# EAGLE design BL (EAGLE 9.6.2)
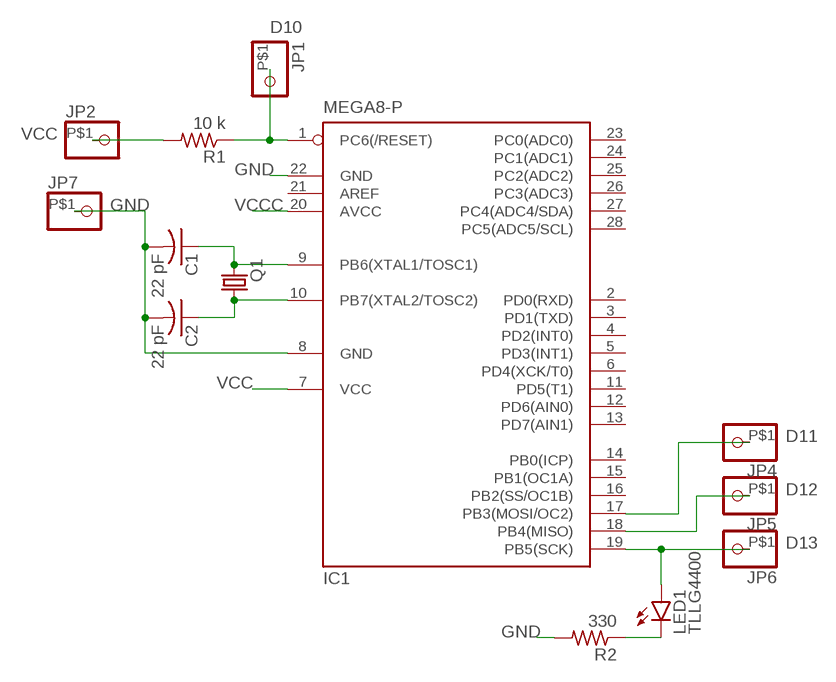
[diagram p0: schematic, sheet 1]

## Parts
C1  22 pF  C-US025-030X050  [C025-030X050]
C2  22 pF  C-US025-030X050  [C025-030X050]
IC1  MEGA8-P  [DIL28-3]
JP1  PINHD-1X1-BIGPOGO  [1X1-BIGPOGO]
JP2  PINHD-1X1-BIGPOGO  [1X1-BIGPOGO]
JP4  PINHD-1X1-BIGPOGO  [1X1-BIGPOGO]
JP5  PINHD-1X1-BIGPOGO  [1X1-BIGPOGO]
JP6  PINHD-1X1-BIGPOGO  [1X1-BIGPOGO]
JP7  PINHD-1X1-BIGPOGO  [1X1-BIGPOGO]
LED1  TLLG4400  [LED3MM]
Q1  CRYSTALHC49S  [HC49/S]
R1  10 k  R-US_0204/7  [0204/7]
R2  330  R-US_0204/7  [0204/7]

## Nets
D10: IC1.1(PC6(/RESET)) JP1.P$1 R1.1
D11: IC1.17(PB3(MOSI/OC2)) JP4.P$1
D12: IC1.18(PB4(MISO)) JP5.P$1
D13: IC1.19(PB5(SCK)) JP6.P$1 LED1.A
GND: C1.2 C2.2 IC1.8(GND) IC1.22(GND) JP7.P$1 R2.2
N$1: C1.1 IC1.9(PB6(XTAL1/TOSC1)) Q1.2
N$2: C2.1 IC1.10(PB7(XTAL2/TOSC2)) Q1.1
N$3: LED1.K(C) R2.1
VCC: IC1.7(VCC) JP2.P$1 R1.2
VCCC: IC1.20(AVCC)
Unconnected: IC1.2(PD0(RXD)) IC1.3(PD1(TXD)) IC1.4(PD2(INT0)) IC1.5(PD3(INT1)) IC1.6(PD4(XCK/T0)) IC1.11(PD5(T1)) IC1.12(PD6(AIN0)) IC1.13(PD7(AIN1)) IC1.14(PB0(ICP)) IC1.15(PB1(OC1A)) IC1.16(PB2(SS/OC1B)) IC1.21(AREF) IC1.23(PC0(ADC0)) IC1.24(PC1(ADC1)) IC1.25(PC2(ADC2)) IC1.26(PC3(ADC3)) IC1.27(PC4(ADC4/SDA)) IC1.28(PC5(ADC5/SCL))

## Library data of the parts
C1 C2 = adafruit:C-US: CAPACITOR, American symbol
IC1 = atmel:MEGA8-P: MICROCONTROLLER 8 Kbytes FLASH, 1 kbytes SRAM, 512 bytes EEPROM, USART, 4-channel 10 bit ADC, 2-channel 8 bit ADC Pin compatible with Atmega48, ATMega88, ATMega168 Source: avr.lbr; OC_FARNELL: unknown; OC_NEWARK: unknown
JP1 JP2 JP4-JP7 = adafruit:PINHD-1X1: Pin header 1x1 for 0.1" spacing With round pins
LED1 = led:TLLG4400: Low Current (2mA) LED 3 mm Tinted Diffused Package color GREEN Source: Data sheet <http://www.farnell.com/datasheets/391098.pdf>; MF: VISHAY SEMICONDUCTOR; OC_FARNELL: 1612435
Q1 = crystal:CRYSTAL: CRYSTAL; OC_FARNELL: 1667008; OC_NEWARK: unknown
R1 R2 = adafruit:R-US_: RESISTOR, American symbol

## Board
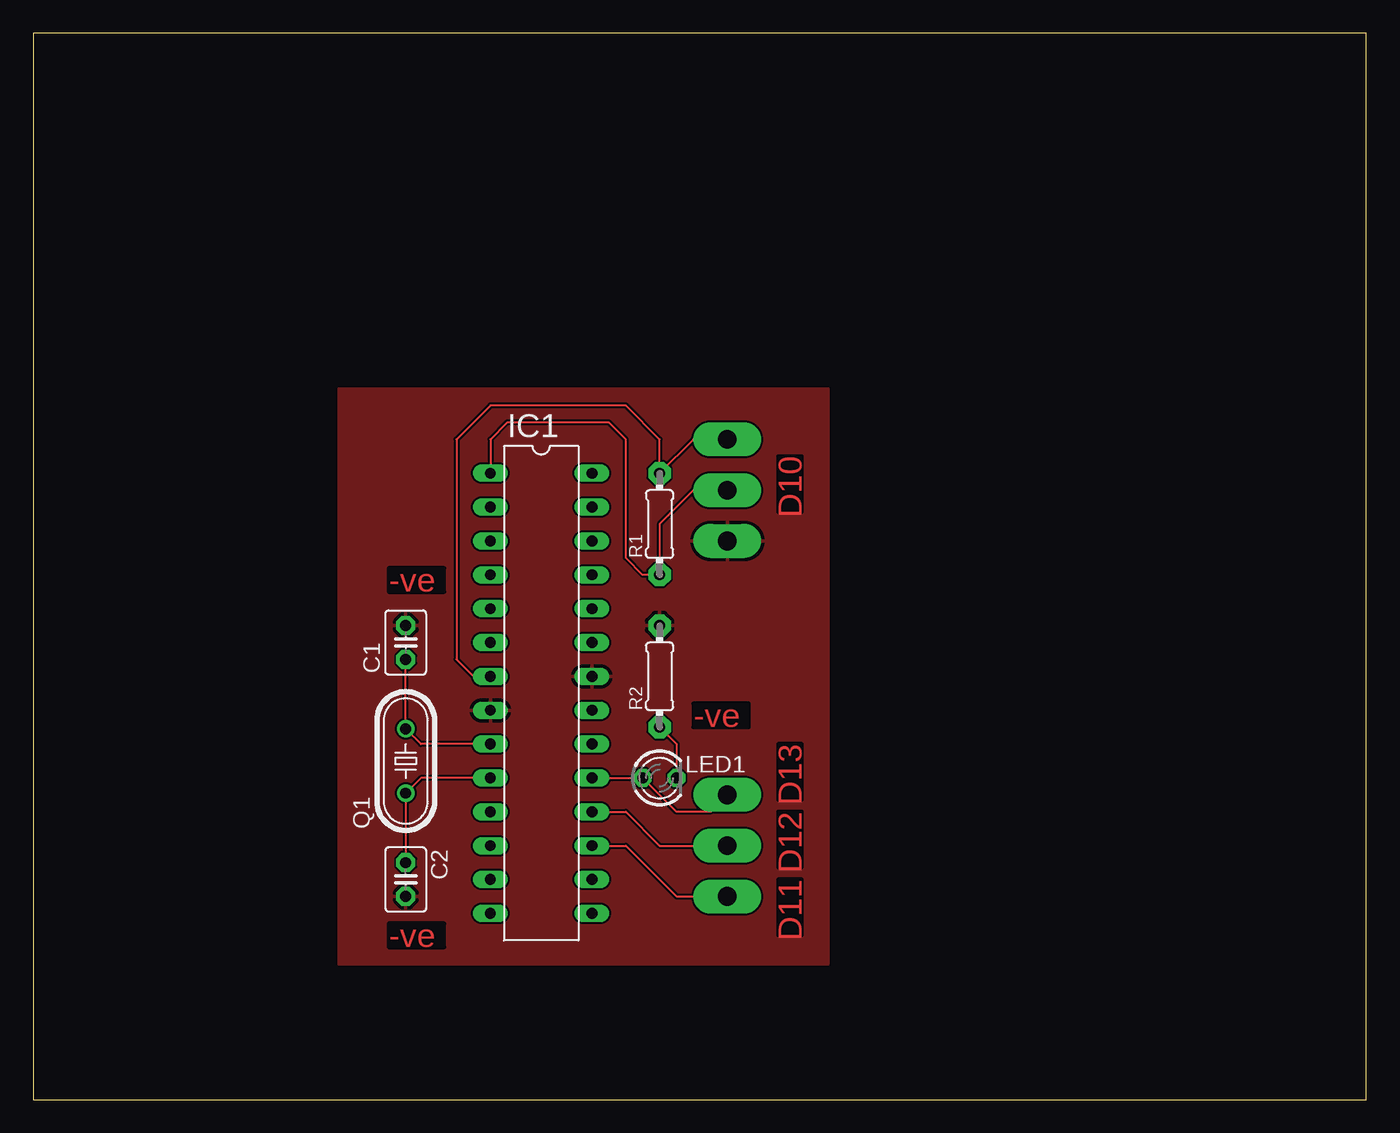
[diagram p1: board, top side]

Size 100 x 80 mm. Coordinates in mm from the lower left corner, seen from the top.
Outline: 0,0 100,0 100,80 0,80 0,0
Copper layers (1*16): Top 0.035mm / dielectric 1.5mm / Bottom 0.035mm
Design rules "default": minimum track width 6mil, minimum drill 0.35mm, track to track 6mil, track to pad 6mil, pad to pad 6mil, via to via 6mil, smd to smd 6mil, copper to edge 40mil, drill to drill 6mil, minimum pad ring 10mil, minimum via ring 8mil, stop-mask expansion 4mil, vias tented up to drill 0mil, thermal gap 10mil

### Footprints (pad centres in the part's own frame; a part is rotated, then mirrored left to right if it is on the bottom)
C025-030X050 = drill 0.813 pad 1.422 octagon: 1 -1.27,0; 2 1.27,0
DIL28-3 = drill 0.813 long: 1 -16.51,-3.81; 2 -13.97,-3.81; 3 -11.43,-3.81; 4 -8.89,-3.81; 5 -6.35,-3.81; 6 -3.81,-3.81; 7 -1.27,-3.81; 8 1.27,-3.81; 9 3.81,-3.81; 10 6.35,-3.81; 11 8.89,-3.81; 12 11.43,-3.81; 13 13.97,-3.81; 14 16.51,-3.81; 15 16.51,3.81; 16 13.97,3.81; 17 11.43,3.81; 18 8.89,3.81; 19 6.35,3.81; 20 3.81,3.81; 21 1.27,3.81; 22 -1.27,3.81; 23 -3.81,3.81; 24 -6.35,3.81; 25 -8.89,3.81; 26 -11.43,3.81; 27 -13.97,3.81; 28 -16.51,3.81
1X1-BIGPOGO = drill 1.4 pad 2.54 long: P$1 0,0
LED3MM = drill 0.813 octagon: A -1.27,0; K 1.27,0
HC49/S = drill 0.813: 1 -2.413,0; 2 2.413,0
0204/7 = drill 0.813 pad 1.676 octagon: 1 -3.81,0; 2 3.81,0

### Placement (x,y rotation side)
C1  27.94,34.29 90 top
C2  27.94,16.51 270 top
IC1  38.1,30.48 270 top
JP1  52.07,45.72 0 top
JP2  52.07,49.53 180 top
JP4  52.07,15.24 0 top
JP5  52.07,19.05 180 top
JP6  52.07,22.86 180 top
JP7  52.07,41.91 0 top
LED1  46.99,24.13 0 top
Q1  27.94,25.4 90 top
R1  46.99,43.18 90 top
R2  46.99,31.75 90 top

### Tracks (layer width: path | path; a pad name or v marks a point on that pad's centre or on a via)
D10
  Top 0.152: IC1.1 34.29,49.53 35.56,50.8 43.18,50.8 44.45,49.53 44.45,40.64 45.72,39.37 R1.1 46.99,43.18 49.53,45.72 JP1.P$1
D11
  Top 0.152: IC1.17 44.45,19.05 48.26,15.24 JP4.P$1
D12
  Top 0.152: IC1.18 44.45,21.59 46.99,19.05 JP5.P$1
D13
  Top 0.152: IC1.19 LED1.A 48.26,21.59 50.8,21.59 JP6.P$1
GND
  pour Top: 22.86,53.34 22.86,10.16 59.69,10.16 59.69,53.34
N$1
  Top 0.152: IC1.9 29.08,26.67 Q1.2 C1.1
N$2
  Top 0.152: IC1.10 29.08,24.13 Q1.1 C2.1
N$3
  Top 0.152: R2.1 48.26,26.67 LED1.K
VCC
  Top 0.152: JP2.P$1 49.53,49.53 R1.2 46.99,49.53 44.45,52.07 34.29,52.07 31.75,49.53 31.75,33.02 33.02,31.75 IC1.7

### Text on the board
Top: D10 | -ve | -ve | D13 | D12 | D11 | -ve